# Altium schematic sheet PWR_Buck_2V_4V_4A.SchDoc: Sayma RTM
size 420 x 297 mm; $$Internal___BlkDate: 23:43:25_12-13-18; $$Internal_NAME_PLACEHOLDER: a3sheet; $$Internal_Resolution: 00001mm; $$NotCommonProperty_@NAME: PWR_Buck_2V_4V_4A; $$NotCommonProperty_@PRINTORDER: 3; $$NotCommonProperty_@SHEET: 1; $$NotCommonProperty_@SHEETTOTAL: 1; $$NotCommonProperty_FORWARD_PCB: 0; CmpIndex: 7; Drawing Author: G.Kasprowicz; Drawing Number: Sayma RTM; Drawing Project: 8 channel SAWG; Drawing Revision: 2.0; SymIndex: 2227; Author: G.Kasprowicz; CompanyName: WUT ISE; DrawnBy: G.Kasprowicz; Organization: WUT ISE; Address1: PW ISE; Address2: Nowowiejska 15/19 00-665 Warsaw; Address3: gkasprow@gmail.com; DocumentNumber: 12; Revision: 1.0; SheetNumber: 12; SheetTotal: 18; ModifiedBy: -; CheckedDate: -; Title2: +2V & +4V buck; DivGrp: WUT ISE; Designer: G.Kasprowicz; ModifiedDate: -; ProjectName: Sensor Box
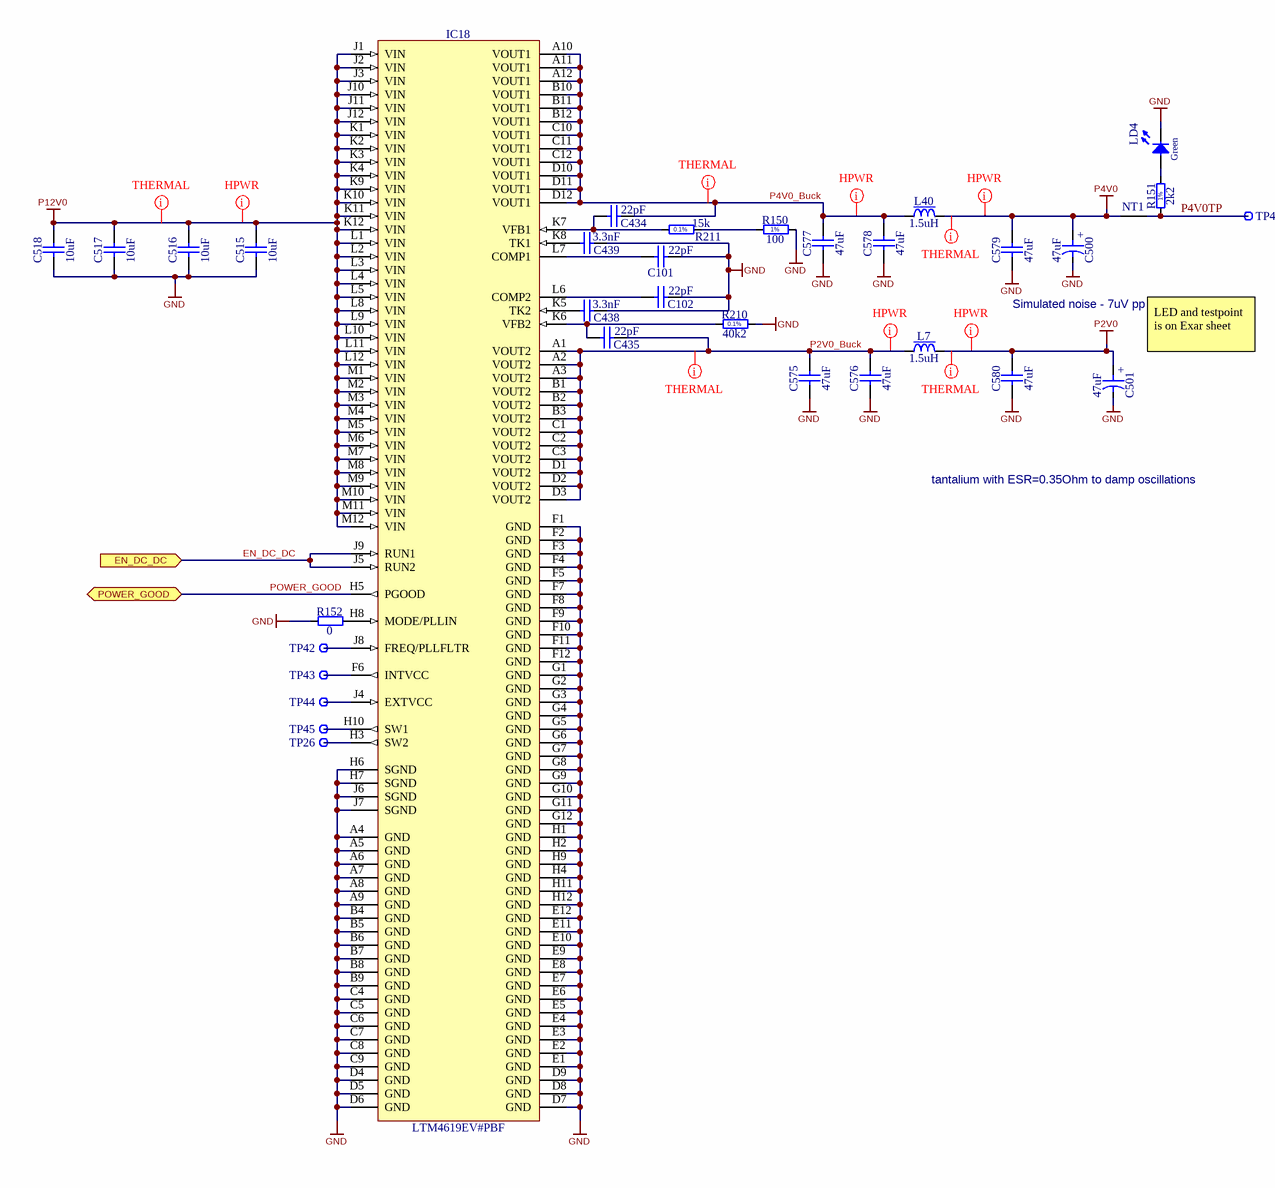
[diagram p0: PWR_Buck_2V_4V_4A.SchDoc]

## Parts
C101  22pF  [CAPC1005X55N]
C102  22pF  [CAPC1005X55N]
C434  22pF  [CAPC1005X55N]
C435  22pF  [CAPC1005X55N]
C438  3.3nF  [CAPC1005X55N]
C439  3.3nF  [CAPC1005X55N]
C500  47uF  [CAPMP6032X280N]
C501  47uF  [CAPMP6032X280N]
C515  10uF  [CAPC2012X95N]
C516  10uF  [CAPC2012X95N]
C517  10uF  [CAPC2012X95N]
C518  10uF  [CAPC2012X95N]
C575  47uF  [CAPC3225X270N]
C576  47uF  [CAPC3225X270N]
C577  47uF  [CAPC3225X270N]
C578  47uF  [CAPC3225X270N]
C579  47uF  [CAPC3225X270N]
C580  47uF  [CAPC3225X270N]
IC18  LTM4619EV#PBF  [LGA144S127P12X12_1500X1500X292R]
L7  1.5uH  [IND_TDK_SPM6530]
L40  1.5uH  [IND_TDK_SPM6530]
LD4  Green  [LED_KINGBRIGHT_KPH-1608CGCK]
NT1  Net Tie  [Net Tie]  (value not drawn)  (net tie, no BOM)
R150  100  [RESC1005X40N]
R151  2k2  [RESC1005X40N]
R152  0  [RESC1005X40N]
R210  40k2  [RESC1608X55N]
R211  15k  [RESC1608X55N]
TP26  Test Point  [TPS127]  (value not drawn)
TP41  Test Point  [TPS127]  (value not drawn)
TP42  Test Point  [TPS127]  (value not drawn)
TP43  Test Point  [TPS127]  (value not drawn)
TP44  Test Point  [TPS127]  (value not drawn)
TP45  Test Point  [TPS127]  (value not drawn)

## Ports
EN_DC_DC (in), POWER_GOOD (bidir)

## Nets
GND: C101.1 C102.1 C438.2 C439.2 C500.2 C501.2 C515.1 C516.1 C517.1 C518.1 C575.1 C576.1 C577.1 C578.1 C579.1 C580.1 IC18.A4(GND) IC18.A5(GND) IC18.A6(GND) IC18.A7(GND) IC18.A8(GND) IC18.A9(GND) IC18.B4(GND) IC18.B5(GND) IC18.B6(GND) IC18.B7(GND) IC18.B8(GND) IC18.B9(GND) IC18.C4(GND) IC18.C5(GND) IC18.C6(GND) IC18.C7(GND) IC18.C8(GND) IC18.C9(GND) IC18.D4(GND) IC18.D5(GND) IC18.D6(GND) IC18.D7(GND) IC18.D8(GND) IC18.D9(GND) IC18.E1(GND) IC18.E2(GND) IC18.E3(GND) IC18.E4(GND) IC18.E5(GND) IC18.E6(GND) IC18.E7(GND) IC18.E8(GND) IC18.E9(GND) IC18.E10(GND) IC18.E11(GND) IC18.E12(GND) IC18.F1(GND) IC18.F2(GND) IC18.F3(GND) IC18.F4(GND) IC18.F5(GND) IC18.F7(GND) IC18.F8(GND) IC18.F9(GND) IC18.F10(GND) IC18.F11(GND) IC18.F12(GND) IC18.G1(GND) IC18.G2(GND) IC18.G3(GND) IC18.G4(GND) IC18.G5(GND) IC18.G6(GND) IC18.G7(GND) IC18.G8(GND) IC18.G9(GND) IC18.G10(GND) IC18.G11(GND) IC18.G12(GND) IC18.H1(GND) IC18.H2(GND) IC18.H4(GND) IC18.H6(SGND) IC18.H7(SGND) IC18.H9(GND) IC18.H11(GND) IC18.H12(GND) IC18.J6(SGND) IC18.J7(SGND) LD4.1(C) R150.2 R152.1 R210.2
P2V0: C501.1 C580.2 L7.2
P4V0: C500.1 C579.2 L40.2 NT1.1
P12V0: C515.2 C516.2 C517.2 C518.2 IC18.J1(VIN) IC18.J2(VIN) IC18.J3(VIN) IC18.J10(VIN) IC18.J11(VIN) IC18.J12(VIN) IC18.K1(VIN) IC18.K2(VIN) IC18.K3(VIN) IC18.K4(VIN) IC18.K9(VIN) IC18.K10(VIN) IC18.K11(VIN) IC18.K12(VIN) IC18.L1(VIN) IC18.L2(VIN) IC18.L3(VIN) IC18.L4(VIN) IC18.L5(VIN) IC18.L8(VIN) IC18.L9(VIN) IC18.L10(VIN) IC18.L11(VIN) IC18.L12(VIN) IC18.M1(VIN) IC18.M2(VIN) IC18.M3(VIN) IC18.M4(VIN) IC18.M5(VIN) IC18.M6(VIN) IC18.M7(VIN) IC18.M8(VIN) IC18.M9(VIN) IC18.M10(VIN) IC18.M11(VIN) IC18.M12(VIN)
EN_DC_DC: IC18.J5(RUN2) IC18.J9(RUN1) ; port EN_DC_DC
P2V0_Buck: C435.1 C575.2 C576.2 IC18.A1(VOUT2) IC18.A2(VOUT2) IC18.A3(VOUT2) IC18.B1(VOUT2) IC18.B2(VOUT2) IC18.B3(VOUT2) IC18.C1(VOUT2) IC18.C2(VOUT2) IC18.C3(VOUT2) IC18.D1(VOUT2) IC18.D2(VOUT2) IC18.D3(VOUT2) L7.1
P4V0_Buck: C434.1 C577.2 C578.2 IC18.A10(VOUT1) IC18.A11(VOUT1) IC18.A12(VOUT1) IC18.B10(VOUT1) IC18.B11(VOUT1) IC18.B12(VOUT1) IC18.C10(VOUT1) IC18.C11(VOUT1) IC18.C12(VOUT1) IC18.D10(VOUT1) IC18.D11(VOUT1) IC18.D12(VOUT1) L40.1
P4V0TP: NT1.2 R151.1 TP41.1
POWER_GOOD: IC18.H5(PGOOD) ; port POWER_GOOD
NetC101_2: C101.2 IC18.L7(COMP1)
NetC102_2: C102.2 IC18.L6(COMP2)
NetC434_2: C434.2 IC18.K7(VFB1) R211.1
NetC435_2: C435.2 IC18.K6(VFB2) R210.1
NetC438_1: C438.1 IC18.K5(TK2)
NetC439_1: C439.1 IC18.K8(TK1)
NetIC18_F6: IC18.F6(INTVCC) TP43.1
NetIC18_H3: IC18.H3(SW2) TP26.1
NetIC18_H8: IC18.H8(MODE/PLLIN) R152.2
NetIC18_H10: IC18.H10(SW1) TP45.1
NetIC18_J4: IC18.J4(EXTVCC) TP44.1
NetIC18_J8: IC18.J8(FREQ/PLLFLTR) TP42.1
NetLD4_2: LD4.2(A) R151.2
NetR150_1: R150.1 R211.2

## Layout directives
net class HPWR: P2V0, P2V0_Buck, P4V0, P4V0_Buck, P12V0
net class THERMAL: P2V0, P2V0_Buck, P4V0, P4V0_Buck, P12V0

## Notes on the sheet
- Simulated noise - 7uV pp
- (near C501) LED and testpoint is on Exar sheet
- tantalium with ESR=0.35Ohm to damp oscillations
- Project/Equipment
- Document
- Designer
- Drawn by
- Check.by
- Copyright WUT ISE 2018.
  This documentation describes Open Hardware and is licensed under the CERN OHL v.1.1. You may redistribute and modify this documentation under the terms of the CERN OHL v.1.1. (http://ohwr.org/CERNOHL). This documentation is distributed WITHOUT ANY EXPRESS OR IMPLIED WARRANTY, INCLUDING OF MERCHANTABILITY, SATISFACTORY QUALITY AND FITNESS FOR A PARTICULAR PURPOSE. Please see the CERN OHL v.1.1 for applicable conditions.
- Contact
- File
- Last Mod.
- Print Date
- Sheet
- Size
- A3
- of
- Rev
- (in symbol CTE6032-28_47UF_16V_10%_LESR0350) +
- (in symbol R0402_2K2_1%_0.0625W_100PPM) 1%
- (in symbol R0402_100R_1%_0.0625W_100PPM) 1%
- (in symbol R0603_15K_0.1%_0.063W_10PPM) 0.1%
- (in symbol R0603_40K2_0.1%_0.063W_10PPM) 0.1%

## Library data of the parts
C101 C102 C434 C435 = CC0402_22PF_50V_5%_C0G: Non-polarised capacitor; Manufacturer: GENERIC; Manufacturer1 Part Number: C0402C220J5GACTU; Part Description: SMD Multilayer Chip Ceramic Capacitor; TC: C0G/NP0; Tolerance: ±5%; Voltage: 50V; Case: 0402; Manufacturer Part Number: CC0402_22PF_50V_5%_C0G; Manufacturer1 Example: KEMET; Part Number: CC0402_22PF_50V_5%_C0G; Pin Count: 2; SMD: Yes; Status: Preferred; Value: 22pF; Component Kind: Standard; Component Type: Standard; Mounted: Yes; Socket: No; Sense: No; Manufacturer1 ComponentHeight: 0.55mm; HelpURL: \\cern.ch\dfs\Applications\Altium\Datasheets\CC0805_C0G_KEMET_(Commercial Grade).pdf; Author: CERN DEM JLC; CreateDate: 03.12.2007; LatestRevisionDate: 03.12.2007
C438 C439 = CC0402_3.3NF_50V_10%_X7R: Non-polarised capacitor; Manufacturer: GENERIC; Manufacturer1 Part Number: 223858715629; Part Description: SMD Multilayer Chip Ceramic Capacitor; TC: X7R; Tolerance: ±10%; Voltage: 50V; Case: 0402; Manufacturer Part Number: CC0402_3.3NF_50V_10%_X7R; Manufacturer1 Example: PHYCOMP; Part Number: CC0402_3.3NF_50V_10%_X7R; Pin Count: 2; SMD: Yes; Status: Not Recommended; Value: 3.3nF; Component Kind: Standard; Component Type: Standard; Mounted: Yes; Socket: No; Sense: No; Manufacturer1 ComponentHeight: 0.55mm; HelpURL: \\cern.ch\dfs\Applications\Altium\Datasheets\CC0402_X7R_PHYCOMP.pdf; Author: CERN DEM JLC; CreateDate: 03.12.2007; LatestRevisionDate: 03.12.2007
C500 C501 = CTE6032-28_47UF_16V_10%_LESR0350: Polarised capacitor; Manufacturer: GENERIC; Manufacturer1 Part Number: TPSC476K016R0350; Part Description: Low ESR 0R350 Solid Tantalum Chip Capacitor; Tolerance: ±10%; Voltage: 16V; Case: C; Manufacturer Part Number: CTE6032-28_47UF_16V_10%_LESR0350; Manufacturer1 Example: AVX; Part Number: CTE6032-28_47UF_16V_10%_LESR0350; Pin Count: 2; SMD: Yes; Value: 47uF; Component Kind: Standard; Component Type: Standard; Status: Preferred; Mounted: Yes; Socket: No; Sense: No; Manufacturer1 ComponentHeight: 2.8mm; HelpURL: \\cern.ch\dfs\Applications\Altium\Datasheets\CTE-LESR_AVX_TPS.pdf; Author: CERN DEM JLC; CreateDate: 05.05.2008; LatestRevisionDate: 20.01.2009
C515-C518 = CC0805_10UF_25V_10%_X5R: Non-polarised capacitor; Manufacturer: GENERIC; Manufacturer1 Part Number: GRM219R61E106KA12D; Part Description: SMD Multilayer Chip Ceramic Capacitor; TC: X5R; Tolerance: ±10%; Voltage: 25V; Case: 0805; Manufacturer Part Number: CC0805_10UF_25V_10%_X5R; Manufacturer1 Example: MURATA; Part Number: CC0805_10UF_25V_10%_X5R; Pin Count: 2; SMD: Yes; Status: Preferred; Value: 10uF; Component Kind: Standard; Component Type: Standard; Mounted: Yes; Socket: No; Sense: No; Manufacturer1 ComponentHeight: 0.95mm; HelpURL: \\cern.ch\dfs\Applications\Altium\Datasheets\CC0805_X5R_MURATA_GRM.pdf; Author: CERN DEM JLC; CreateDate: 25.10.2012; LatestRevisionDate: 06.09.2016
C575-C580 = CC1210_47UF_10V_10%_X7R: Non-polarised capacitor; Manufacturer: GENERIC; Manufacturer1 Part Number: GRM32ER71A476KE15; Part Description: SMD Multilayer Chip Ceramic Capacitor; TC: X7R; Tolerance: ±10%; Voltage: 10V; Case: 1210; Manufacturer Part Number: CC1210_47UF_10V_10%_X7R; Manufacturer1 Example: MURATA; Part Number: CC1210_47UF_10V_10%_X7R; Pin Count: 2; SMD: Yes; Status: None; Value: 47uF; Component Kind: Standard; Component Type: Standard; Mounted: Yes; Socket: No; Sense: No; Manufacturer1 ComponentHeight: 2.7mm; HelpURL: \\cern.ch\dfs\Applications\Altium\Datasheets\CC1210_X7R_MURATA.pdf; Author: CERN DEM BC; CreateDate: 18.11.2015; LatestRevisionDate: 18.11.2015
IC18 = LTM4619EV#PBF: 4.5V-26.5V To 0.8V-5V, Iout 4A Dual DC/DC uModule Regulator; Manufacturer: LINEAR TECHNOLOGY; Part Description: 4.5V-26.5V To 0.8V-5V, Iout 4A Dual DC-DC uModule Regulator; Bonding: No; PressFit: No; Case: LGA144; ComponentHeight: 2.92mm; Device: LTM4619EV#PBF; Manufacturer Part Number: LTM4619EV#PBF; Mounted: Yes; PackageDescription: LGA,1.27mm pitch,square;144 pin,12 columns X 12 rows,15.00mm X 15.00mm X 2.92mm H (w/reversed pins); Part Number: LTM4619EV#PBF; Pin Count: 144; Sense: No; SMD: Yes; Socket: No; Component Kind: Standard; Component Type: Standard; HelpURL: \\cern.ch\dfs\Applications\Altium\Datasheets\LTM4619EV#PBF.pdf; Author: CERN DEM JLC; CreateDate: 06.05.2010; LatestRevisionDate: 07.12.2011
L7 L40 = IND_1.5UH_20%_TDK_SPM6530: Inductor With Core; Manufacturer Part Number: SPM6530T-1R5M100; Manufacturer: TDK; Part Description: SMD Inductor for Power Circuits (Wound Metal), SPM Series; Power: 11A; Resistance: 0.0097R; Tolerance: ±20%; ComponentHeight: 3mm; Part Number: IND_1.5UH_20%_TDK_SPM6530; Pin Count: 2; SMD: Yes; Value: 1.5uH; Component Kind: Standard; Component Type: Standard; Status: None; Mounted: Yes; Socket: No; Sense: No; HelpURL: \\cern.ch\dfs\Applications\Altium\Datasheets\IND_TDK_SPM6530.pdf; Author: CERN DEM MR; CreateDate: 08.11.2016; LatestRevisionDate: 08.11.2016
LD4 = LED_KINGBRIGHT_KPH-1608CGCK: LED Green 1C 2A; Part Description: SMD Green LED, Case 1.6mmX0.8mm(0603), 0.65mm Thickness; Bonding: No; PressFit: No; Author: CERN DEM JLC; Color: Green; Component Kind: Standard; Component Type: Standard; ComponentHeight: 0.65mm; CreateDate: 03.07.2017; HelpURL: \\cern.ch\dfs\Applications\Altium\Datasheets\LED_KINGBRIGHT_KPH-1608CGCK.pdf; LatestRevisionDate: 03.07.2017; Manufacturer Part Number: KPH-1608CGCK; Manufacturer: KINGBRIGHT; Mounted: Yes; PackageDescription: SMT Green LED, Case 0603, Body L 1.6 x W 0.8mm H 0.65mm; Part Number: LED_KINGBRIGHT_KPH-1608CGCK; Pin Count: 2; Sense: No; SMD: Yes; Socket: No
NT1 = Net Tie: Part Description: Net Tie (2 Nets); Mounted: No; Part Number: Net Tie; Component Type: Net Tie; Pin Count: 2; Family: Net Tie; Socket: No; SMD: No; Sense: No; Status: None; ComponentHeight: 0mm; HelpURL: Undefined; Author: CERN DEM JLC; CreateDate: 22.03.2011; LatestRevisionDate: 22.03.2011; PackageDescription: 2 Plated Through Hole For Coaxial Cable Link: Hole Dia.=1.4mm Pad Dia.=2.5mm
R150 = R0402_100R_1%_0.0625W_100PPM: Resistor - 1%; Manufacturer: GENERIC; Manufacturer1 Part Number: 232270671001L; Part Description: General Purpose Thick Film Chip Resistor; TC: ±100ppm/°C; PressFit: No; Case: 0402; Manufacturer Part Number: R0402_100R_1%_0.0625W_100PPM; Manufacturer1 ComponentHeight: 0.4mm; Manufacturer1 Example: YAGEO PHYCOMP; Part Number: R0402_100R_1%_0.0625W_100PPM; Pin Count: 2; Power: 0.0625W; Sense: No; SMD: Yes; Status: Not Recommended; Tolerance: ±1%; Value: 100; Component Kind: Standard; Component Type: Standard; Mounted: Yes; Socket: No; HelpURL: \\cern.ch\dfs\Applications\Altium\Datasheets\R0402_Phycomp_RC0402.pdf; Author: CERN DEM JLC; CreateDate: 03.12.2007; LatestRevisionDate: 17.10.2012
R151 = R0402_2K2_1%_0.0625W_100PPM: Resistor - 1%; Manufacturer: GENERIC; Manufacturer1 Part Number: 232270672202L; Part Description: General Purpose Thick Film Chip Resistor; TC: ±100ppm/°C; PressFit: No; Case: 0402; Manufacturer Part Number: R0402_2K2_1%_0.0625W_100PPM; Manufacturer1 ComponentHeight: 0.4mm; Manufacturer1 Example: YAGEO PHYCOMP; Part Number: R0402_2K2_1%_0.0625W_100PPM; Pin Count: 2; Power: 0.0625W; Sense: No; SMD: Yes; Status: Not Recommended; Tolerance: ±1%; Value: 2k2; Component Kind: Standard; Component Type: Standard; Mounted: Yes; Socket: No; HelpURL: \\cern.ch\dfs\Applications\Altium\Datasheets\R0402_Phycomp_RC0402.pdf; Author: CERN DEM JLC; CreateDate: 03.12.2007; LatestRevisionDate: 17.10.2012
R152 = R0402_0R_JUMPER: Resistor; Manufacturer: GENERIC; Manufacturer1 Part Number: 232270591001L; Part Description: 1A (0.05R Max DC Resistance) Zero Ohm Jumper; PressFit: No; Case: 0402; Manufacturer Part Number: R0402_0R_JUMPER; Manufacturer1 ComponentHeight: 0.4mm; Manufacturer1 Example: YAGEO PHYCOMP; Part Number: R0402_0R_JUMPER; Pin Count: 2; Sense: No; SMD: Yes; Status: Not Recommended; Value: 0; Component Kind: Standard; Component Type: Standard; Mounted: Yes; Socket: No; HelpURL: \\cern.ch\dfs\Applications\Altium\Datasheets\R0402_Phycomp_RC0402.pdf; Author: CERN DEM JLC; CreateDate: 03.12.2007; LatestRevisionDate: 17.10.2012
R210 = R0603_40K2_0.1%_0.063W_10PPM: Resistor - 0.1%; Manufacturer: GENERIC; Manufacturer1 Part Number: RN73C1J40K2BTDF; Part Description: Thin Film Chip Resistor; Power: 0.063W; TC: ±10ppm; PressFit: No; Case: 0603; Manufacturer Part Number: R0603_40K2_0.1%_0.063W_10PPM; Manufacturer1 ComponentHeight: 0.5mm; Manufacturer1 Example: TYCO HOLSWORTHY; Part Number: R0603_40K2_0.1%_0.063W_10PPM; Pin Count: 2; Sense: No; SMD: Yes; Status: Not Recommended; Tolerance: ±0.1%; Value: 40k2; Component Kind: Standard; Component Type: Standard; Mounted: Yes; Socket: No; HelpURL: \\cern.ch\dfs\Applications\Altium\Datasheets\R0603_Tyco_RN73.pdf; Author: CERN DEM JLC; CreateDate: 03.12.2007; LatestRevisionDate: 13.03.2008
R211 = R0603_15K_0.1%_0.063W_10PPM: Resistor - 0.1%; Manufacturer: GENERIC; Manufacturer1 Part Number: RN73C1J15KBTDF; Part Description: Thin Film Chip Resistor; Power: 0.063W; TC: ±10ppm; PressFit: No; Case: 0603; Manufacturer Part Number: R0603_15K_0.1%_0.063W_10PPM; Manufacturer1 ComponentHeight: 0.5mm; Manufacturer1 Example: TYCO HOLSWORTHY; Part Number: R0603_15K_0.1%_0.063W_10PPM; Pin Count: 2; Sense: No; SMD: Yes; Status: Not Recommended; Tolerance: ±0.1%; Value: 15k; Component Kind: Standard; Component Type: Standard; Mounted: Yes; Socket: No; HelpURL: \\cern.ch\dfs\Applications\Altium\Datasheets\R0603_Tyco_RN73.pdf; Author: CERN DEM JLC; CreateDate: 03.12.2007; LatestRevisionDate: 13.03.2008
TP26 TP41-TP45 = SMD_PAD_1.27X1.27MM: Part Description: 1.27mm x 1.27mm PCB Copper Area (SMD Test Point); Mounted: No; ComponentHeight: 0mm; Family: Test Point; Part Number: SMD_PAD_1.27X1.27MM; Pin Count: 1; Sense: No; SMD: Yes; Socket: No; Status: None; Component Kind: Standard (No BOM); Component Type: Standard (No BOM); HelpURL: Undefined; Author: CERN DEM JLC; CreateDate: 12.01.2008; LatestRevisionDate: 12.01.2008; PackageDescription: 1.27mm x 1.27mm PCB Copper Area (SMD Test Point)